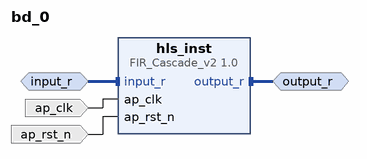
[diagram p0: block diagram of the top level]
# Vivado block design bd_0, xck26-sfvc784-2LV-c, Vivado 2024.2
create_bd_design bd_0

create_bd_intf_port -mode Slave -vlnv xilinx.com:interface:axis_rtl:1.0 input_r
set_property -dict [list \
  CONFIG.FREQ_HZ 100000000.0 \
  CONFIG.HAS_TKEEP 0 \
  CONFIG.HAS_TLAST 0 \
  CONFIG.HAS_TREADY 1 \
  CONFIG.HAS_TSTRB 0 \
  CONFIG.LAYERED_METADATA undef \
  CONFIG.TDATA_NUM_BYTES 2 \
  CONFIG.TDEST_WIDTH 0 \
  CONFIG.TID_WIDTH 0 \
  CONFIG.TUSER_WIDTH 0 \
] [get_bd_intf_ports input_r]
create_bd_intf_port -mode Master -vlnv xilinx.com:interface:axis_rtl:1.0 output_r
set_property -dict {CONFIG.FREQ_HZ 100000000.0} [get_bd_intf_ports output_r]
create_bd_port -dir I -type clk ap_clk
set_property -dict {CONFIG.FREQ_HZ 100000000.0} [get_bd_ports ap_clk]
create_bd_port -dir I -type rst ap_rst_n

create_bd_cell -type ip -vlnv xilinx.com:hls:FIR_Cascade_v2:1.0 hls_inst

# ---- connections ----

connect_bd_intf_net [get_bd_intf_ports output_r] [get_bd_intf_pins hls_inst/output_r]
connect_bd_intf_net -intf_net input_r_0_1 [get_bd_intf_ports input_r] [get_bd_intf_pins hls_inst/input_r]
connect_bd_net -net ap_clk_0_1 [get_bd_ports ap_clk] [get_bd_pins hls_inst/ap_clk]
connect_bd_net -net ap_rst_n_0_1 [get_bd_ports ap_rst_n] [get_bd_pins hls_inst/ap_rst_n]

validate_bd_design
save_bd_design
